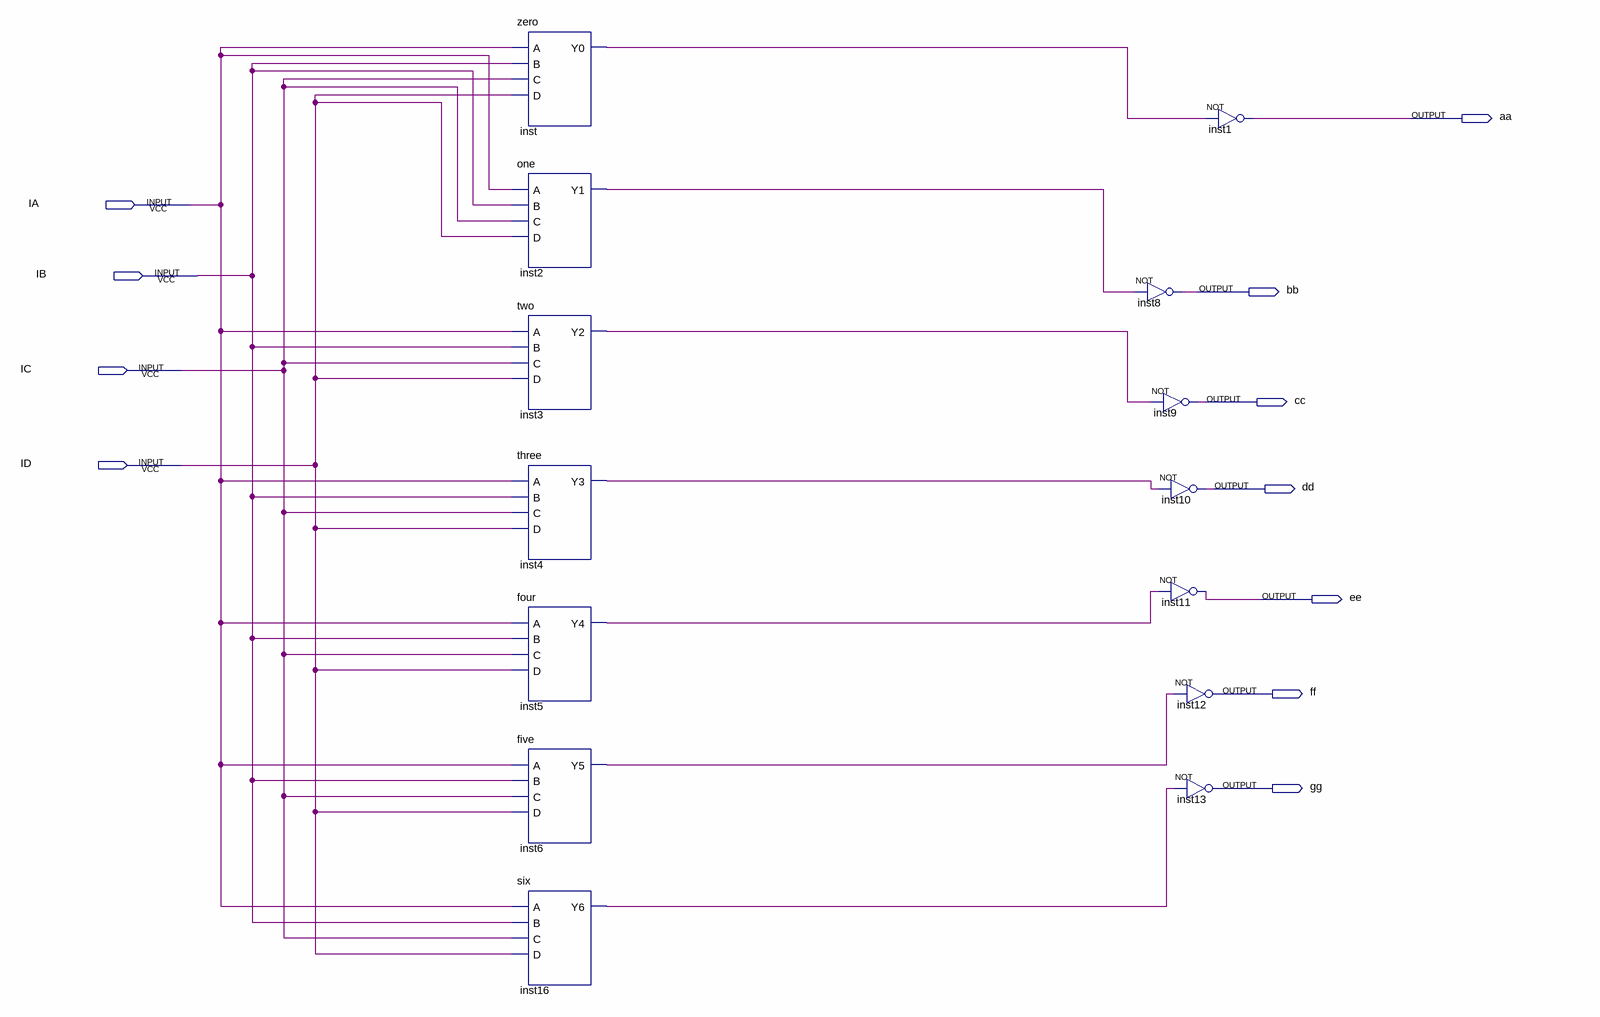
[diagram p0: schematic sheet]
// Quartus schematic Segment.bdf as structural Verilog: 14 symbols, 11 pins
module Segment (
  input  IA,
  input  IB,
  input  IC,
  input  ID,
  output aa,
  output bb,
  output cc,
  output dd,
  output ee,
  output ff,
  output gg
);

  wire inst2_y1, inst3_y2, inst4_y3, inst5_y4, inst6_y5, inst16_y6, inst_y0;

  zero inst (.A(IA), .B(IB), .C(IC), .D(ID), .Y0(inst_y0));
  one inst2 (.A(IA), .B(IB), .C(IC), .D(ID), .Y1(inst2_y1));
  two inst3 (.A(IA), .B(IB), .C(IC), .D(ID), .Y2(inst3_y2));
  three inst4 (.A(IA), .B(IB), .C(IC), .D(ID), .Y3(inst4_y3));
  four inst5 (.A(IA), .B(IB), .C(IC), .D(ID), .Y4(inst5_y4));
  five inst6 (.A(IA), .B(IB), .C(IC), .D(ID), .Y5(inst6_y5));
  six inst16 (.A(IA), .B(IB), .C(IC), .D(ID), .Y6(inst16_y6));
  not inst8 (bb, inst2_y1);
  not inst9 (cc, inst3_y2);
  not inst10 (dd, inst4_y3);
  not inst11 (ee, inst5_y4);
  not inst12 (ff, inst6_y5);
  not inst13 (gg, inst16_y6);
  not inst1 (aa, inst_y0);
endmodule
